# Altium schematic sheet FSMC.SchDoc
size A4
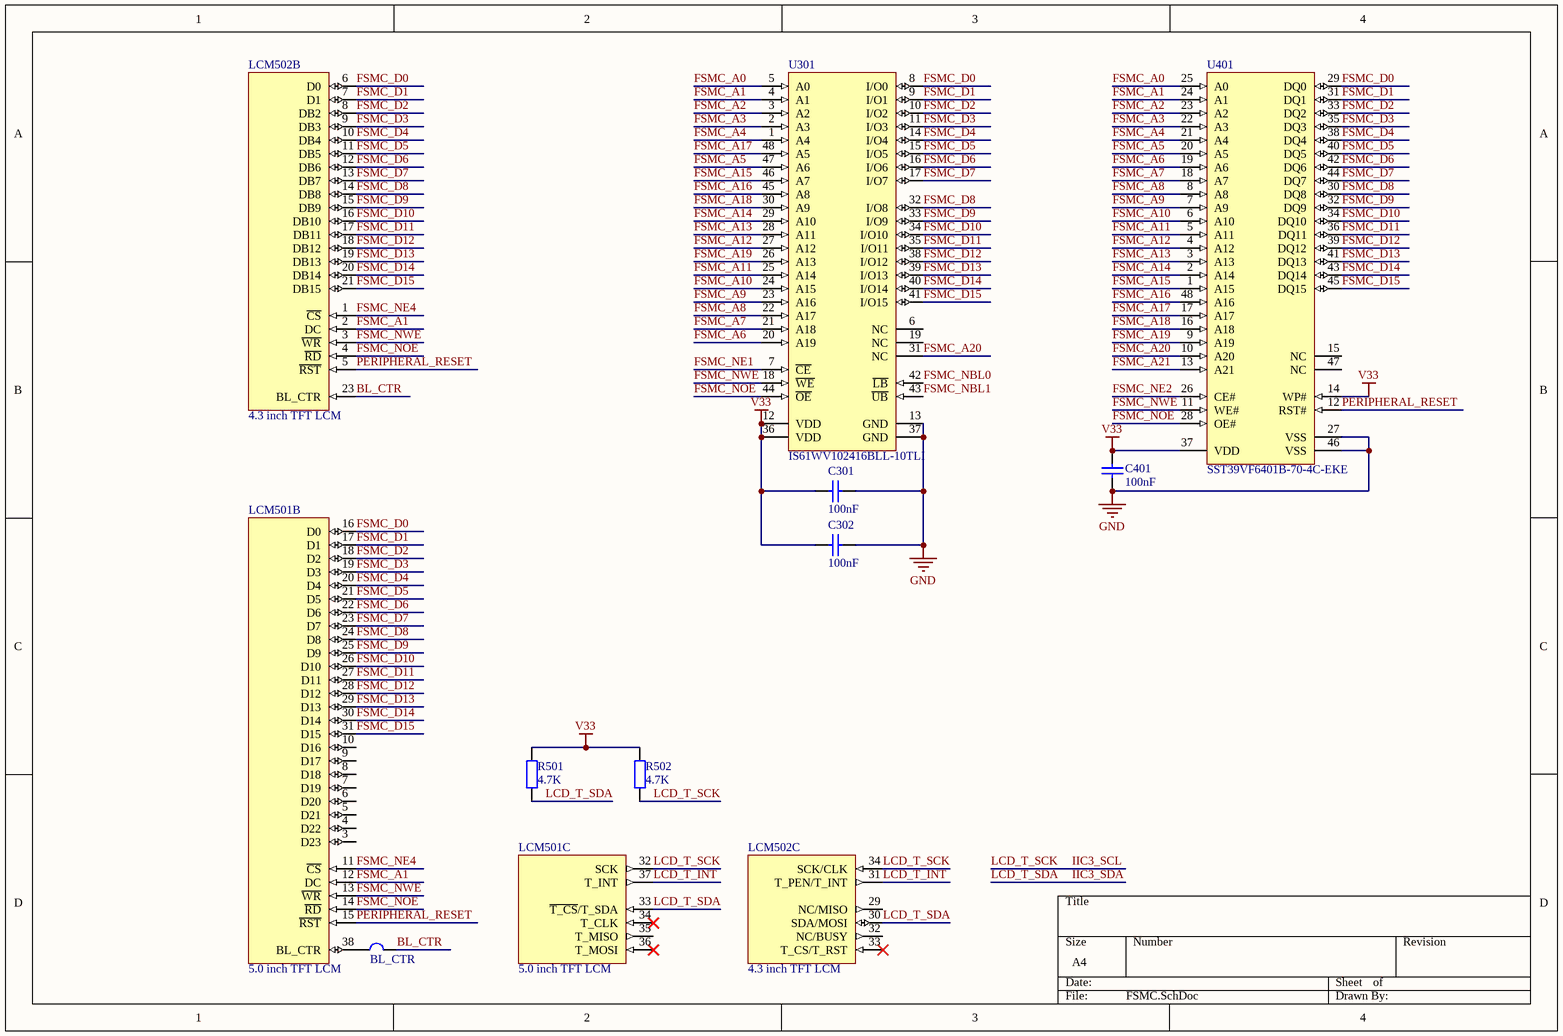
[diagram p0: FSMC.SchDoc]

## Parts
BL_CTR  Switch  [SWITCH]  (value not drawn)
C301  value 100nF  [0603C]  (hidden comment: MLCC)
C302  value 100nF  [0603C]  (hidden comment: MLCC)
C401  value 100nF  [0603C]  (hidden comment: MLCC)
LCM501  5.0 inch TFT LCM  [LCM5.0]  (parts B,C of 3)
LCM502  4.3 inch TFT LCM  [LCM4.3_ATK]  (parts B,C of 3)
R501  value 4.7K  [0603R]  (hidden comment: Resistor)
R502  value 4.7K  [0603R]  (hidden comment: Resistor)
U301  IS61WV102416BLL-10TLI  [ISSI-TSOP-1-48-12000X20000DE_N]
U401  SST39VF6401B-70-4C-EKE  [MCHP-TSOP-EK48_N]

## Nets
GND: C301.2 C302.2 C401.1 U301.13(GND) U301.37(GND) U401.27(VSS) U401.46(VSS)
V33: C301.1 C302.1 C401.2 R501.2 R502.2 U301.12(VDD) U301.36(VDD) U401.14(WP#) U401.37(VDD)
BL_CTR: BL_CTR.2 LCM502.23(BL_CTR)
FSMC_A0: U301.5(A0) U401.25(A0)
FSMC_A1: LCM501.12(DC) LCM502.2(DC) U301.4(A1) U401.24(A1)
FSMC_A2: U301.3(A2) U401.23(A2)
FSMC_A3: U301.2(A3) U401.22(A3)
FSMC_A4: U301.1(A4) U401.21(A4)
FSMC_A5: U301.47(A6) U401.20(A5)
FSMC_A6: U301.20(A19) U401.19(A6)
FSMC_A7: U301.21(A18) U401.18(A7)
FSMC_A8: U301.22(A17) U401.8(A8)
FSMC_A9: U301.23(A16) U401.7(A9)
FSMC_A10: U301.24(A15) U401.6(A10)
FSMC_A11: U301.25(A14) U401.5(A11)
FSMC_A12: U301.27(A12) U401.4(A12)
FSMC_A13: U301.28(A11) U401.3(A13)
FSMC_A14: U301.29(A10) U401.2(A14)
FSMC_A15: U301.46(A7) U401.1(A15)
FSMC_A16: U301.45(A8) U401.48(A16)
FSMC_A17: U301.48(A5) U401.17(A17)
FSMC_A18: U301.30(A9) U401.16(A18)
FSMC_A19: U301.26(A13) U401.9(A19)
FSMC_A20: U301.31(NC) U401.10(A20)
FSMC_A21: U401.13(A21)
FSMC_D0: LCM501.16(D0) LCM502.6(D0) U301.8(I/O0) U401.29(DQ0)
FSMC_D1: LCM501.17(D1) LCM502.7(D1) U301.9(I/O1) U401.31(DQ1)
FSMC_D2: LCM501.18(D2) LCM502.8(DB2) U301.10(I/O2) U401.33(DQ2)
FSMC_D3: LCM501.19(D3) LCM502.9(DB3) U301.11(I/O3) U401.35(DQ3)
FSMC_D4: LCM501.20(D4) LCM502.10(DB4) U301.14(I/O4) U401.38(DQ4)
FSMC_D5: LCM501.21(D5) LCM502.11(DB5) U301.15(I/O5) U401.40(DQ5)
FSMC_D6: LCM501.22(D6) LCM502.12(DB6) U301.16(I/O6) U401.42(DQ6)
FSMC_D7: LCM501.23(D7) LCM502.13(DB7) U301.17(I/O7) U401.44(DQ7)
FSMC_D8: LCM501.24(D8) LCM502.14(DB8) U301.32(I/O8) U401.30(DQ8)
FSMC_D9: LCM501.25(D9) LCM502.15(DB9) U301.33(I/O9) U401.32(DQ9)
FSMC_D10: LCM501.26(D10) LCM502.16(DB10) U301.34(I/O10) U401.34(DQ10)
FSMC_D11: LCM501.27(D11) LCM502.17(DB11) U301.35(I/O11) U401.36(DQ11)
FSMC_D12: LCM501.28(D12) LCM502.18(DB12) U301.38(I/O12) U401.39(DQ12)
FSMC_D13: LCM501.29(D13) LCM502.19(DB13) U301.39(I/O13) U401.41(DQ13)
FSMC_D14: LCM501.30(D14) LCM502.20(DB14) U301.40(I/O14) U401.43(DQ14)
FSMC_D15: LCM501.31(D15) LCM502.21(DB15) U301.41(I/O15) U401.45(DQ15)
FSMC_NBL0: U301.42(~{LB})
FSMC_NBL1: U301.43(~{UB})
FSMC_NE1: U301.7(~{CE})
FSMC_NE2: U401.26(CE#)
FSMC_NE4: LCM501.11(~{CS}) LCM502.1(~{CS})
FSMC_NOE: LCM501.14(~{RD}) LCM502.4(~{RD}) U301.44(~{OE}) U401.28(OE#)
FSMC_NWE: LCM501.13(~{WR}) LCM502.3(~{WR}) U301.18(~{WE}) U401.11(WE#)
IIC3_SCL: LCM501.32(SCK) LCM502.34(SCK/CLK) R502.1  [also labelled LCD_T_SCK]
IIC3_SDA: LCM501.33(~{T_CS}/T_SDA) LCM502.30(SDA/MOSI) R501.1  [also labelled LCD_T_SDA]
LCD_T_INT: LCM501.37(T_INT) LCM502.31(T_PEN/T_INT)
PERIPHERAL_RESET: LCM501.15(~{RST}) LCM502.5(~{RST}) U401.12(RST#)
NetBL_CTR_1: BL_CTR.1 LCM501.38(BL_CTR)

Not connected (* = marked no-connect by the designer): LCM501 3(D23) 4(D22) 5(D21) 6(D20) 7(D19) 8(D18) 9(D17) 10(D16) 34(T_CLK)* 35(T_MISO) 36(T_MOSI)*; LCM502 29(NC/MISO) 32(NC/BUSY) 33(T_CS/T_RST)*; U301 6(NC) 19(NC); U401 15(NC) 47(NC)

## Library data of the parts
LCM501 = LCM5.0
LCM502 = LCM4.3_ATK
U301 = CMP-0513-00250-1: 16 M High Speed Asynchronous CMOS SRAM with 3.3 V Supply, 1 M x 16, -40 to 85 degC, 48-Pin SOP (TSOP-1-48), Pb-Free; Manufacturer: Integrated Silicon Solution Inc (ISSI); Organization: 1M x 16; Density: 16M; Packing: Tray / Tube; Speed (ns): 10; ComponentLink1Description: Manufacturer URL; ComponentLink2Description: Datasheet; ComponentLink2URL: http://www.issi.com/WW/pdf/61WV102416ALL.pdf; PackageDescription: 48-Pin 12 x 20 mm TSOP-1, Pitch 0.5 mm; RoHS: Pb-Free; ComponentLink3Description: Package Specification; ComponentLink1URL: http://www.issi.com/US/index.shtml; PackageReference: TSOP-1-48; ComponentLink3URL: http://www.issi.com/WW/pdf/61WV102416ALL.pdf; PackageVersion: Rev. B, 07/2006; PartNumber: IS61WV102416BLL-10TLI; DatasheetVersion: Rev. F; Mounting Technology: Surface Mount
U401 = CMP-0378-00196-1: 64 Mbit Multi-Purpose Flash Plus, 2.7 to 3.6 V, 0 to 70 degC, 48-pin TSOP (EK48), Tray; Manufacturer: Microchip; PackageDescription: 48-Lead Thin Small Outline Package, 18.4 x 12 mm Body, 0.5 mm Pitch; ComponentLink3Description: Package Specification; Code_JEDEC: MO-142; ComponentLink2Description: Datasheet; ComponentLink3URL: http://ww1.microchip.com/downloads/en/DeviceDoc/25008A.pdf; PackageReference: TSOP-EK48; PackageVersion: Rev. A; PartNumber: SST39VF6401B-70-4C-EKE; ComponentLink4URL: http://www.microchip.com/SST39VF6401B; ComponentLink4Description: Product URL; DatasheetVersion: Rev. A; ComponentLink1Description: Manufacturer URL; Mounting Technology: Surface Mount; ComponentLink2URL: http://ww1.microchip.com/downloads/en/DeviceDoc/25008A.pdf; ComponentLink1URL: http://www.microchip.com